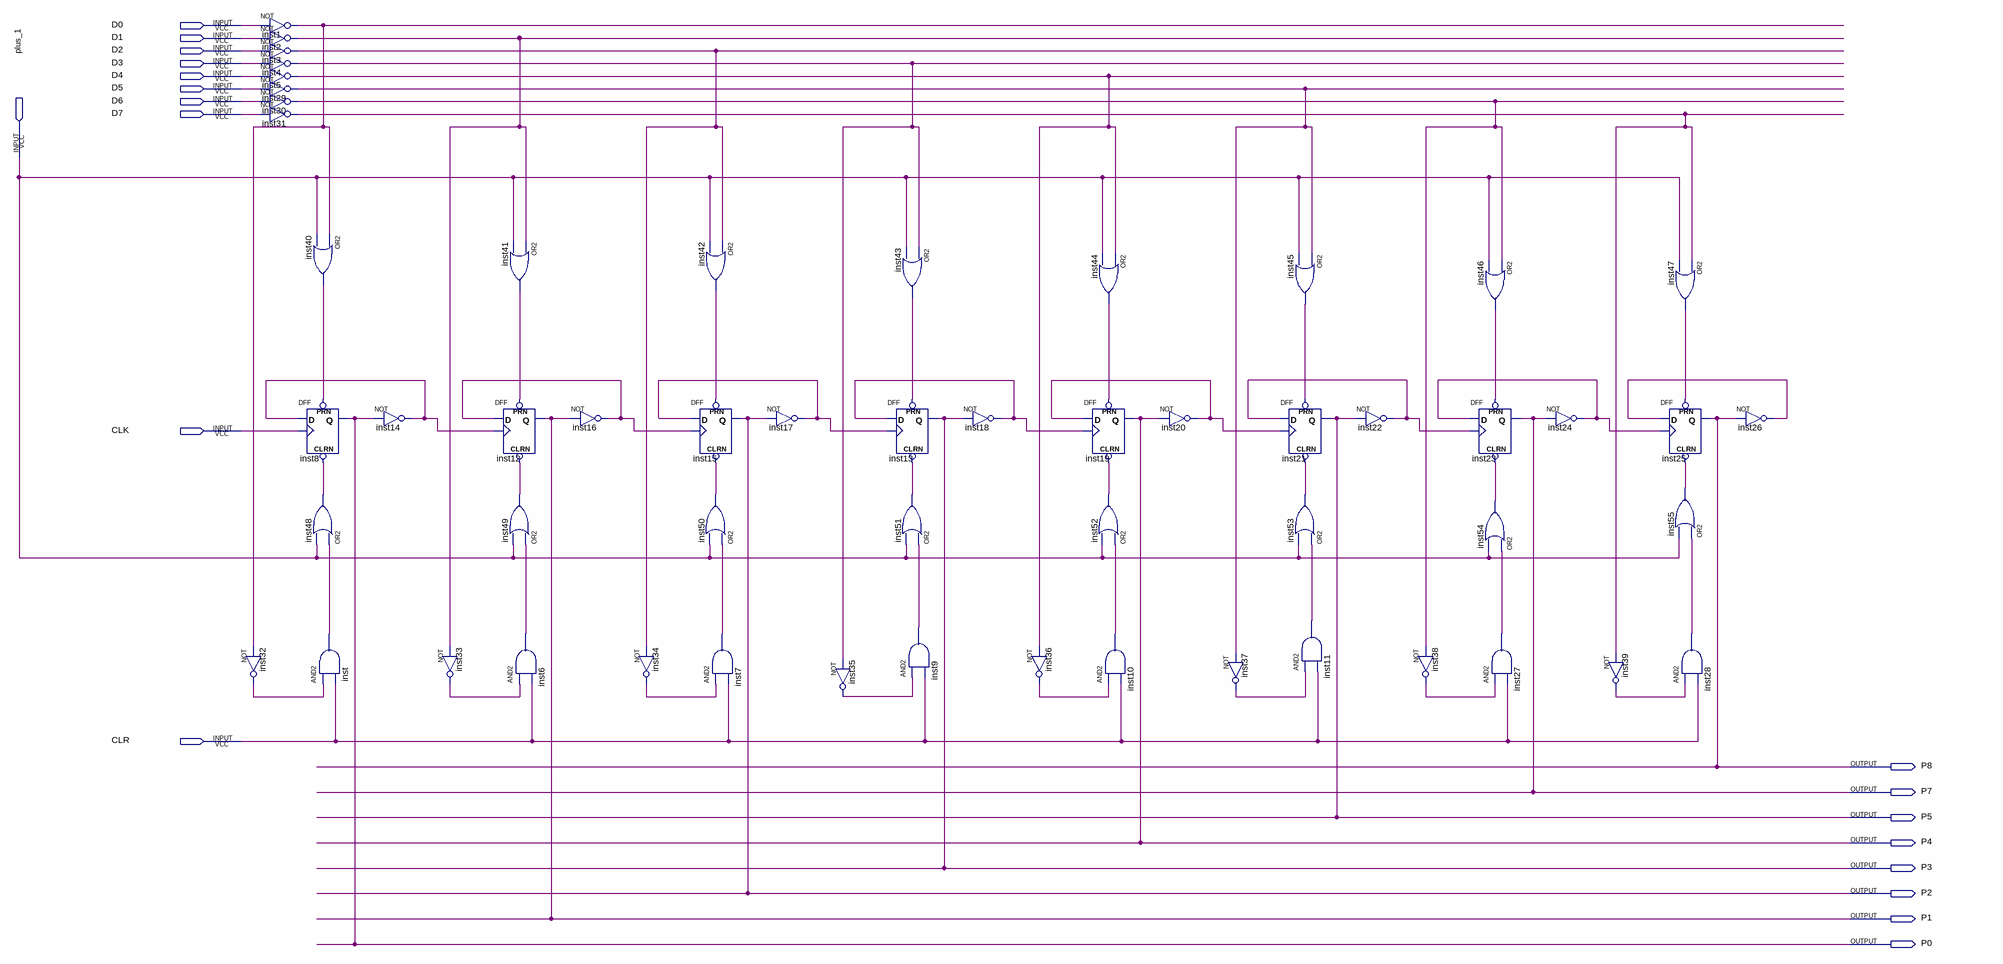
[diagram p0: schematic sheet]
// Quartus schematic Asynchronous-mode-256-Plus-1-counter.bdf as structural Verilog: 56 symbols, 19 pins
module \Asynchronous-mode-256-Plus-1-counter  (
  input  D0,
  input  D1,
  input  D2,
  input  D3,
  input  D4,
  input  D5,
  input  D6,
  input  D7,
  input  plus_1,
  input  CLK,
  input  CLR,
  output P8,
  output P7,
  output P5,
  output P4,
  output P3,
  output P2,
  output P1,
  output P0
);

  wire inst1_out, inst2_out, inst3_out, inst4_out, inst5_out, inst6_out, inst7_out, inst9_out, inst10_out,
       inst11_out, inst14_out, inst16_out, inst17_out, inst18_out, inst20_out, inst22_out, inst24_out,
       inst26_out, inst27_out, inst28_out, inst29_out, inst30_out, inst31_out, inst32_out, inst33_out,
       inst34_out, inst35_out, inst36_out, inst37_out, inst38_out, inst39_out, inst40_out, inst41_out,
       inst42_out, inst43_out, inst44_out, inst45_out, inst46_out, inst47_out, inst48_out, inst49_out,
       inst50_out, inst51_out, inst52_out, inst53_out, inst54_out, inst55_out, inst_out;

  not inst1 (inst1_out, D0);
  not inst2 (inst2_out, D1);
  not inst3 (inst3_out, D2);
  not inst4 (inst4_out, D3);
  not inst5 (inst5_out, D4);
  not inst29 (inst29_out, D5);
  not inst30 (inst30_out, D6);
  not inst31 (inst31_out, D7);
  not inst32 (inst32_out, inst1_out);
  or inst40 (inst40_out, inst1_out, plus_1);
  DFF inst8 (.CLRN(inst48_out), .CLK(CLK), .D(inst14_out), .PRN(inst40_out), .Q(P0));
  or inst48 (inst48_out, inst_out, plus_1);
  and inst (inst_out, inst32_out, CLR);
  not inst14 (inst14_out, P0);
  not inst33 (inst33_out, inst2_out);
  or inst41 (inst41_out, inst2_out, plus_1);
  DFF inst12 (.CLRN(inst49_out), .CLK(inst14_out), .D(inst16_out), .PRN(inst41_out), .Q(P1));
  or inst49 (inst49_out, inst6_out, plus_1);
  and inst6 (inst6_out, inst33_out, CLR);
  not inst16 (inst16_out, P1);
  not inst34 (inst34_out, inst3_out);
  or inst42 (inst42_out, inst3_out, plus_1);
  DFF inst15 (.CLRN(inst50_out), .CLK(inst16_out), .D(inst17_out), .PRN(inst42_out), .Q(P2));
  or inst50 (inst50_out, inst7_out, plus_1);
  and inst7 (inst7_out, inst34_out, CLR);
  not inst17 (inst17_out, P2);
  not inst35 (inst35_out, inst4_out);
  or inst43 (inst43_out, inst4_out, plus_1);
  DFF inst13 (.CLRN(inst51_out), .CLK(inst17_out), .D(inst18_out), .PRN(inst43_out), .Q(P3));
  or inst51 (inst51_out, inst9_out, plus_1);
  and inst9 (inst9_out, inst35_out, CLR);
  not inst18 (inst18_out, P3);
  not inst36 (inst36_out, inst5_out);
  DFF inst19 (.CLRN(inst52_out), .CLK(inst18_out), .D(inst20_out), .PRN(inst44_out), .Q(P4));
  or inst44 (inst44_out, inst5_out, plus_1);
  or inst52 (inst52_out, inst10_out, plus_1);
  and inst10 (inst10_out, inst36_out, CLR);
  not inst20 (inst20_out, P4);
  not inst37 (inst37_out, inst29_out);
  or inst45 (inst45_out, inst29_out, plus_1);
  DFF inst21 (.CLRN(inst53_out), .CLK(inst20_out), .D(inst22_out), .PRN(inst45_out), .Q(P5));
  or inst53 (inst53_out, inst11_out, plus_1);
  and inst11 (inst11_out, inst37_out, CLR);
  not inst22 (inst22_out, P5);
  not inst38 (inst38_out, inst30_out);
  or inst46 (inst46_out, inst30_out, plus_1);
  DFF inst23 (.CLRN(inst54_out), .CLK(inst22_out), .D(inst24_out), .PRN(inst46_out), .Q(P7));
  or inst54 (inst54_out, inst27_out, plus_1);
  and inst27 (inst27_out, inst38_out, CLR);
  not inst24 (inst24_out, P7);
  not inst39 (inst39_out, inst31_out);
  or inst47 (inst47_out, inst31_out, plus_1);
  DFF inst25 (.CLRN(inst55_out), .CLK(inst24_out), .D(inst26_out), .PRN(inst47_out), .Q(P8));
  or inst55 (inst55_out, inst28_out, plus_1);
  and inst28 (inst28_out, inst39_out, CLR);
  not inst26 (inst26_out, P8);
endmodule
